# EAGLE design relays (EAGLE 6.6.0)

## Sheet 1 of 3: Connectors & Zero Cross
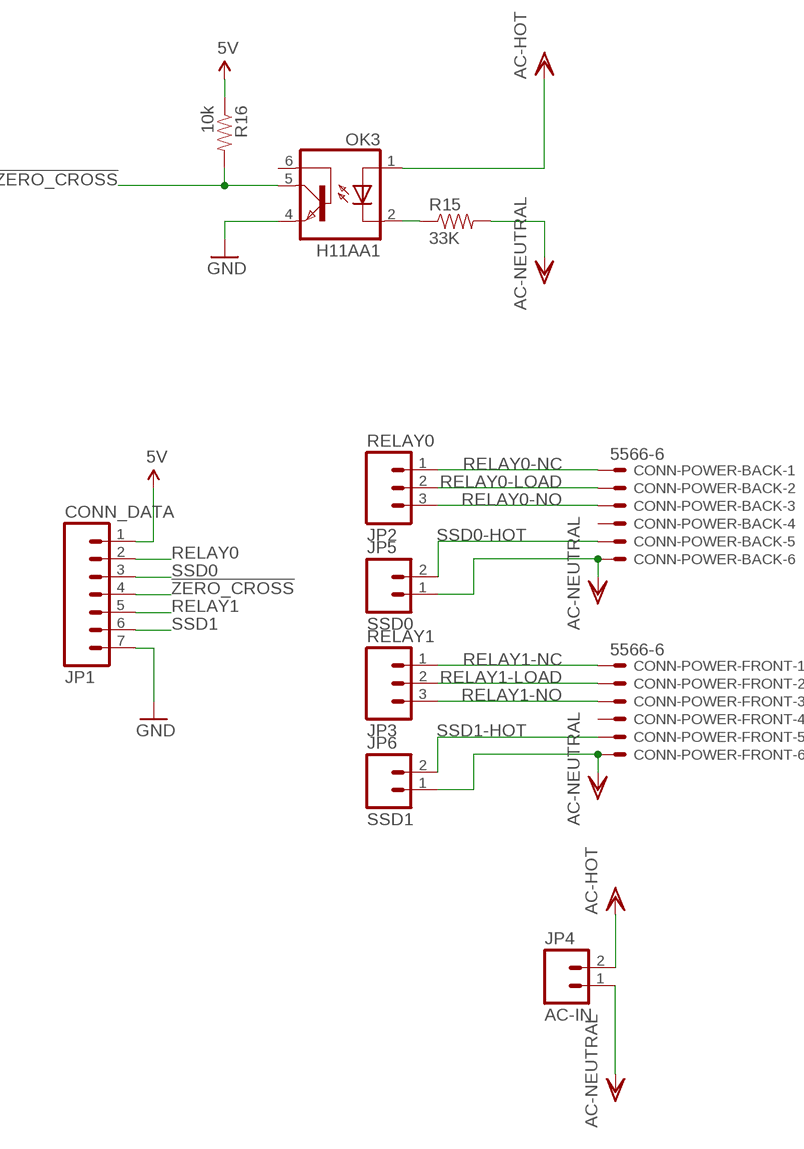
[diagram p0: schematic, sheet 1]

### Parts
CONN-POWER-BACK  5566-6  [5566-6]
CONN-POWER-FRONT  5566-6  [5566-6]
JP1  CONN_DATA  M07LONGPADS  [1X07_LONGPADS]
JP2  RELAY0  M03-SCREW-5MM  [SCREWTERMINAL-5MM-3]
JP3  RELAY1  M03-SCREW-5MM  [SCREWTERMINAL-5MM-3]
JP4  AC-IN  M025MM  [SCREWTERMINAL-5MM-2]
JP5  SSD0  M025MM  [SCREWTERMINAL-5MM-2]
JP6  SSD1  M025MM  [SCREWTERMINAL-5MM-2]
OK3  H11AA1  H11A1SM  [DIL6-SMD]
R15  33K  RESISTOR0603-RES  [0603-RES]
R16  10k  RESISTOR0603-RES  [0603-RES]

### Nets
5V: JP1.1 R16.1 ; also sheet 3
!ZERO_CROSS: JP1.4 OK3.5(COL) R16.2
AC-HOT: JP4.2 OK3.1(A) ; also sheet 2
AC-NEUTRAL: CONN-POWER-BACK.6 CONN-POWER-FRONT.6 JP4.1 JP5.1 JP6.1 R15.2
GND: JP1.7 OK3.4(EMI) ; also sheet 2,3
N$23: OK3.2(C) R15.1
RELAY0: JP1.2 ; also sheet 3
RELAY0-LOAD: CONN-POWER-BACK.2 JP2.2 ; also sheet 3
RELAY0-NC: CONN-POWER-BACK.1 JP2.1 ; also sheet 3
RELAY0-NO: CONN-POWER-BACK.3 JP2.3 ; also sheet 3
RELAY1: JP1.5 ; also sheet 3
RELAY1-LOAD: CONN-POWER-FRONT.2 JP3.2 ; also sheet 3
RELAY1-NC: CONN-POWER-FRONT.1 JP3.1 ; also sheet 3
RELAY1-NO: CONN-POWER-FRONT.3 JP3.3 ; also sheet 3
SSD0: JP1.3 ; also sheet 2
SSD0-HOT: CONN-POWER-BACK.5 JP5.2 ; also sheet 2
SSD1: JP1.6 ; also sheet 2
SSD1-HOT: CONN-POWER-FRONT.5 JP6.2 ; also sheet 2
Unconnected: CONN-POWER-BACK.4 CONN-POWER-FRONT.4 OK3.6(BAS)

## Sheet 2 of 3: Triac SSR
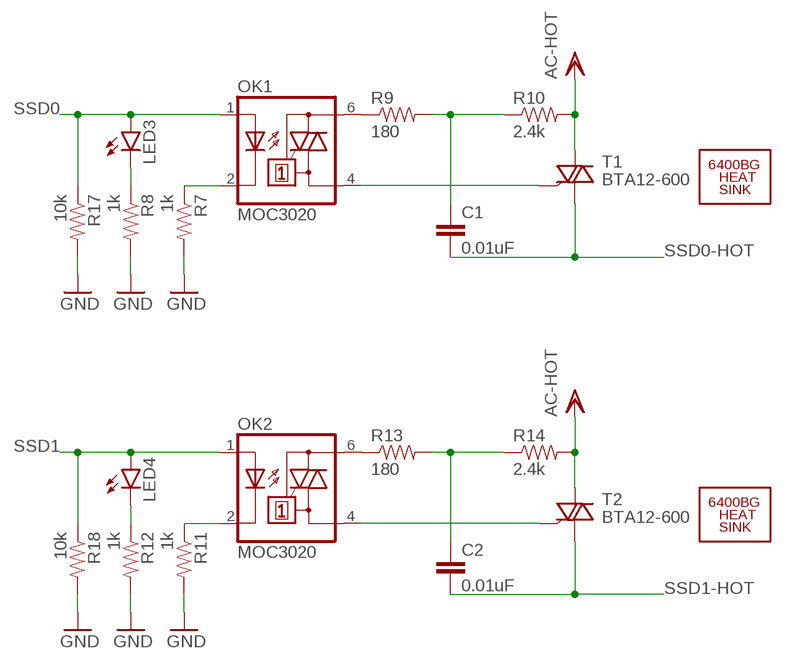
[diagram p1: schematic, sheet 2]

### Parts
C1  0.01uF  CAP0603-CAP  [0603-CAP]
C2  0.01uF  CAP0603-CAP  [0603-CAP]
LED3  LED0603  [LED-0603]
LED4  LED0603  [LED-0603]
OK1  MOC3020  MOC3031S  [DIL6-SMD]
OK2  MOC3020  MOC3031S  [DIL6-SMD]
R7  1k  RESISTOR0603-RES  [0603-RES]
R8  1k  RESISTOR0603-RES  [0603-RES]
R9  180  RESISTOR0603-RES  [0603-RES]
R10  2.4k  RESISTOR0603-RES  [0603-RES]
R11  1k  RESISTOR0603-RES  [0603-RES]
R12  1k  RESISTOR0603-RES  [0603-RES]
R13  180  RESISTOR0603-RES  [0603-RES]
R14  2.4k  RESISTOR0603-RES  [0603-RES]
R17  10k  RESISTOR0603-RES  [0603-RES]
R18  10k  RESISTOR0603-RES  [0603-RES]
T1  BTA12-600  BT136  [TO220AB]
T2  BTA12-600  BT136  [TO220AB]
U$3  6400BG_HEATSINK  [6400BG_HEATSINK]
U$4  6400BG_HEATSINK  [6400BG_HEATSINK]

### Nets
AC-HOT: R10.2 R14.2 T1.2(A2) T2.2(A2) ; also sheet 1
GND: R7.2 R8.2 R11.2 R12.2 R17.2 R18.2 ; also sheet 1,3
N$7: OK1.2(C) R7.1
N$8: LED3.C R8.1
N$10: OK1.6(A2) R9.1
N$11: C1.1 R9.2 R10.1
N$12: OK2.2(C) R11.1
N$13: OK1.4(A1) T1.3(G)
N$14: LED4.C R12.1
N$16: OK2.6(A2) R13.1
N$17: C2.1 R13.2 R14.1
N$18: OK2.4(A1) T2.3(G)
SSD0: LED3.A OK1.1(A) R17.1 ; also sheet 1
SSD0-HOT: C1.2 T1.1(A1) ; also sheet 1
SSD1: LED4.A OK2.1(A) R18.1 ; also sheet 1
SSD1-HOT: C2.2 T2.1(A1) ; also sheet 1

## Sheet 3 of 3: Relay
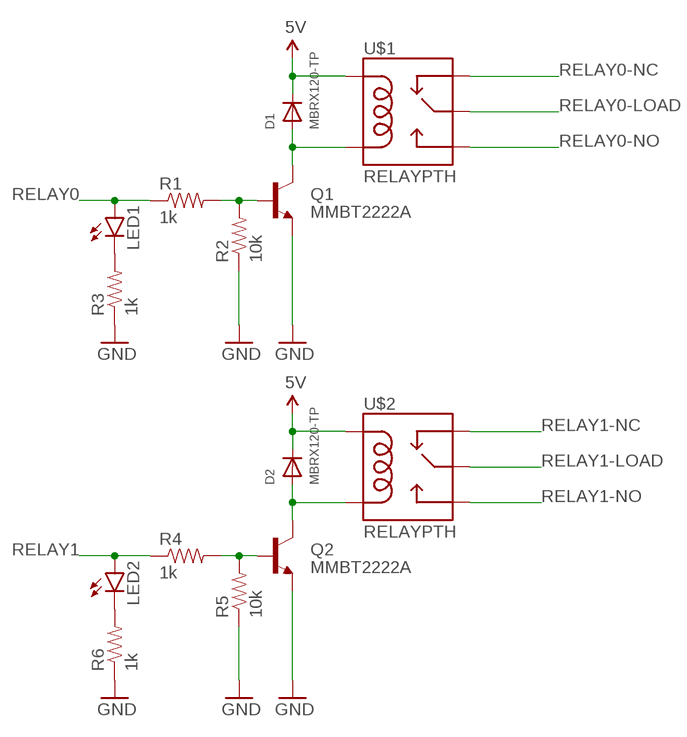
[diagram p2: schematic, sheet 3]

### Parts
D1  MBRX120-TP  DIODESOD-123  [SOD-123]
D2  MBRX120-TP  DIODESOD-123  [SOD-123]
LED1  LED0603  [LED-0603]
LED2  LED0603  [LED-0603]
Q1  MMBT2222A  TRANSISTOR_NPNMMBT2222A  [SOT23-3]
Q2  MMBT2222A  TRANSISTOR_NPNMMBT2222A  [SOT23-3]
R1  1k  RESISTOR0603-RES  [0603-RES]
R2  10k  RESISTOR0603-RES  [0603-RES]
R3  1k  RESISTOR0603-RES  [0603-RES]
R4  1k  RESISTOR0603-RES  [0603-RES]
R5  10k  RESISTOR0603-RES  [0603-RES]
R6  1k  RESISTOR0603-RES  [0603-RES]
U$1  RELAYPTH  [RELAY-G5Q]
U$2  RELAYPTH  [RELAY-G5Q]

### Nets
5V: D1.C D2.C U$1.5(COIL1) U$2.5(COIL1) ; also sheet 1
GND: Q1.2(E) Q2.2(E) R2.1 R3.1 R5.1 R6.1 ; also sheet 1,2
N$1: Q1.1(B) R1.2 R2.2
N$2: LED1.C R3.2
N$3: D1.A Q1.3(C) U$1.1(COIL2)
N$4: Q2.1(B) R4.2 R5.2
N$5: LED2.C R6.2
N$6: D2.A Q2.3(C) U$2.1(COIL2)
RELAY0: LED1.A R1.1 ; also sheet 1
RELAY0-LOAD: U$1.2(MAIN) ; also sheet 1
RELAY0-NC: U$1.4(NC) ; also sheet 1
RELAY0-NO: U$1.3(NO) ; also sheet 1
RELAY1: LED2.A R4.1 ; also sheet 1
RELAY1-LOAD: U$2.2(MAIN) ; also sheet 1
RELAY1-NC: U$2.4(NC) ; also sheet 1
RELAY1-NO: U$2.3(NO) ; also sheet 1

## Library data of the parts
C1 C2 = SparkFun-Passives:CAP: Capacitor Standard 0603 ceramic capacitor, and 0.1" leaded capacitor.
CONN-POWER-BACK CONN-POWER-FRONT = con-molex:5566-6: Mini FIT connector 6 pol Source: http://www.molex.com; MPN: 95566-61002; OC_FARNELL: unknown; OC_NEWARK: 22K8620
D1 D2 = adafruit:DIODE: Diode SMADIODE - SMA Surface Mount Package 20V 1A Schottky Diode Digikey: 641-1014-6-ND DO-1N4148 - Through Hole Small Current Diode SOD-123 20V 1 A (.5mV Vf) Schottky Diode - Digikey: MBRX120TPMSCT-ND SOD-323 10V 570mA (.38mV Vf, 3ns) Schottky Diode - Digikey: ZLLS410CT-ND SOD-523 30V 30mA Schottky Diode (RB751S-40TE61) - Digikey: RB751S-40TE61CT-ND SOT23-R/W - SOT23 Package (R = Solder Paste/Reflow Ovens, W = Hand-Soldering) BAT54Film 40V 300mA - Digikey: 497-7162-1-ND
JP1 = SparkFun-Connectors:M07: Header 7 Standard 7-pin 0.1" header. Use with straight break away headers (SKU : PRT-00116), right angle break away headers (PRT-00553), swiss pins (PRT-00743), machine pins (PRT-00117), and female headers (PRT-00115). NOTES ON THE VARIANTS LOCK and LOCK_LONGPADS... This footprint was designed to help hold the alignment of a through-hole component (i.e. 7-pin header) while soldering it into place. You may notice that each hole has been shifted either up or down by 0.005 of an inch from it's more standard position (which is usually a perfectly straight line). This slight alteration caused the pins (the squares in the middle) to touch the edges of the holes. Because they are alternating, it causes a "brace" to hold the header in place. 0.005 has proven to be the perfect amount of "off-center" position when using our standard breakaway headers. Although looks a little odd when you look at the bare footprint, once you have a header in there, the alteration is very hard to notice. Also, if you push a header all the way into place, it is covered up entirely on the bottom side. This idea of altering the position of holes to aid alignment will be further integrated into the Sparkfun Library for other footprints. It can help hold any component with 3 or more connection pins.
JP2 JP3 = SparkFun-Connectors:M03: Header 3 Standard 3-pin 0.1" header. Use with straight break away headers (SKU : PRT-00116), right angle break away headers (PRT-00553), swiss pins (PRT-00743), machine pins (PRT-00117), and female headers (PRT-00115). Molex polarized connector foot print use with SKU : PRT-08232 with associated crimp pins and housings.; STOREFRONT_ID: PRT-08433
JP4-JP6 = SparkFun-Connectors:M02: Standard 2-pin 0.1" header. Use with - straight break away headers ( PRT-00116) - right angle break away headers (PRT-00553) - swiss pins (PRT-00743) - machine pins (PRT-00117) - female headers (PRT-00115) Molex polarized connector foot print use with: PRT-08233 with associated crimp pins and housings. 2.54_SCREWTERM for use with PRT-10571. 3.5mm Screw Terminal footprints for PRT-08084 5mm Screw Terminal footprints for use with PRT-08432; STOREFRONT_ID: PRT-08432
LED1-LED4 = SparkFun-LED:LED: LEDs Standard schematic elements and footprints for 5mm, 3mm, 1206, and 0603 sized LEDs. 5mm - Spark Fun Electronics SKU : COM-00529 (and others)
OK1 OK2 = optocoupler:MOC30*: 6-Pin DIP Zero-Cross Optoisolators Triac Driver Output (250/400 Volt Peak) Source: Data sheet <http://www.fairchildsemi.com/ds/MO/MOC3031M.pdf> The old path of data sheet not more available 2013-05-06.; MF: FAIRCHILD SEMICONDUCTOR; MPN: MOC3031SM; OC_FARNELL: unknown; OC_NEWARK: 34C1335
OK3 = optocoupler:H11A*?M: General Purpose 6-Pin Phototransistor Optocouplers Source: http://www.fairchildsemi.com/ds/4N/4N35-M.pdf; OC_FARNELL: unknown; OC_NEWARK: unknown
Q1 Q2 = SparkFun-DiscreteSemi:TRANSISTOR_NPN: Generic NPN BJT MMBT2222A - TRANS-08049 (SOT-23, 1A 40V) MPSA42 - TRANS-09116 (SOT-23, 500mA 300V) MMBT5088LT1G - TRANS-11160 (SOT-23, 50 mA 30V) BC547 - COM-08928 <http://www.sparkfun.com/products/8928> (TO-92 45V 100mA) (1.Collector 2.Base 3.Emitter) 2N3904 - COM-00521 <http://www.sparkfun.com/products/521> (TO-92 40V 200mA) (1.Emitter 2.Base 3.Collector) P2N2222A - COM-12852 <http://www.sparkfun.com/products/12852> (TO-92 40V 600mA) (1.Collector 2.Base 3.Emitter); PROD_ID: TRANS-08049
R1-R18 = SparkFun-Passives:RESISTOR: Resistor Basic schematic elements and footprints for 0603, 1206, and PTH resistors.
T1 T2 = triac:BT136: Triac BT136 series E sensitive gate Source: http://www.nxp.com/acrobat_download/datasheets/BT136_SERIES_E_2.pdf
U$1 U$2 = SparkFun-Electromechanical:RELAY: SPDT relay (COM-00101)
U$3 U$4 = SparkFun-Electromechanical:6400BG_HEATSINK: Multiwatt heatsink, PRT-09576

## Board
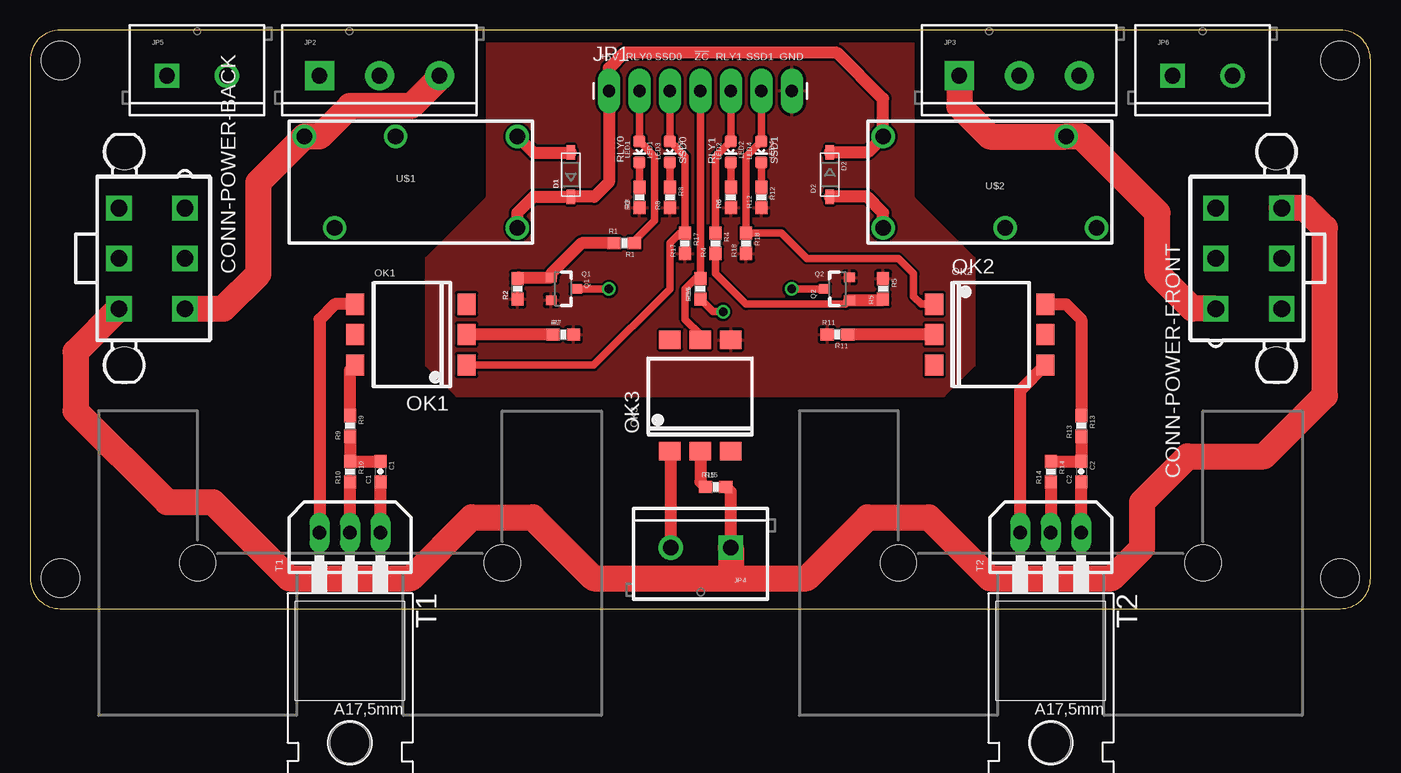
[diagram p3: board, top side]
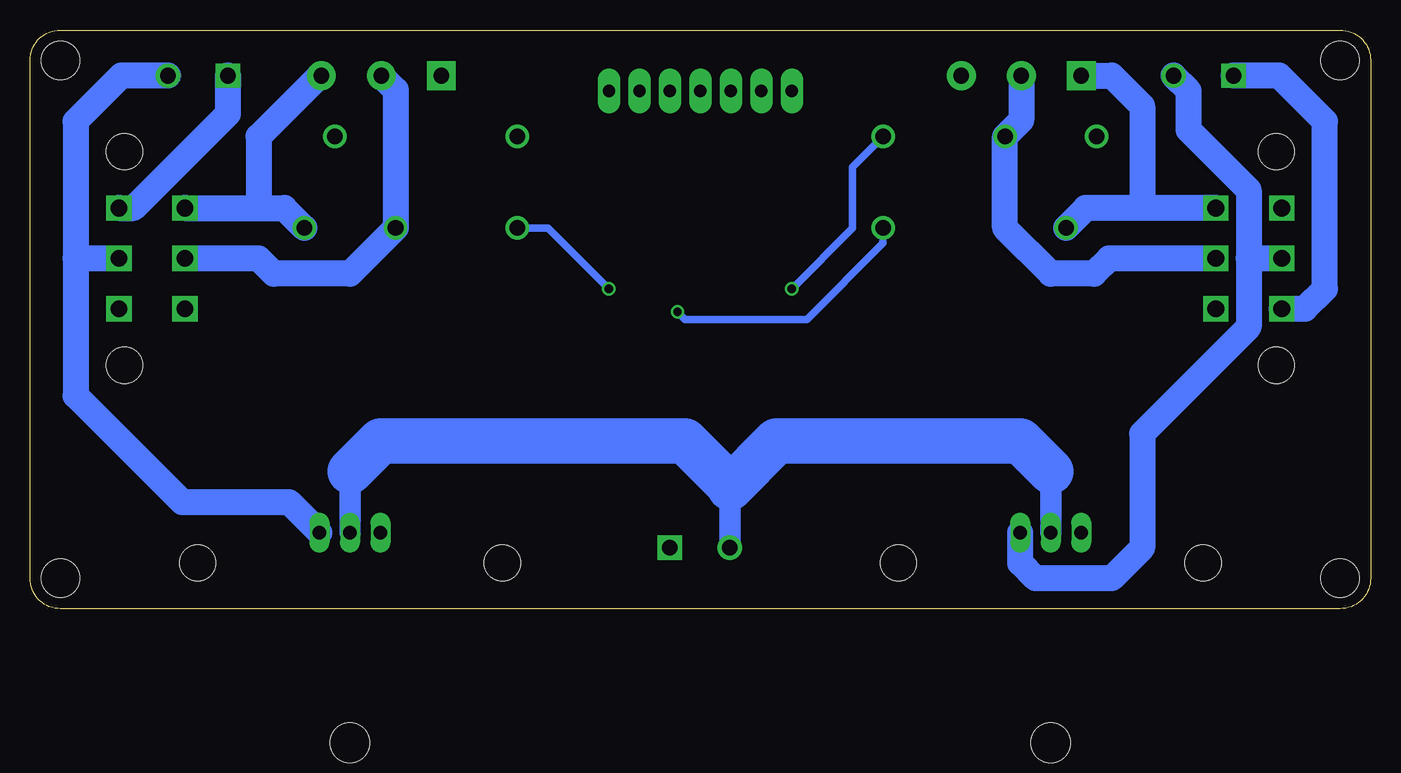
[diagram p4: board, bottom side, seen from below]

Size 111.76 x 48.26 mm. Coordinates in mm from the lower left corner, seen from the top.
Outline: 0,45.72 0,2.54 arc90 2.54,0 109.22,0 arc90 111.76,2.54 111.76,45.72 arc90 109.22,48.26 2.54,48.26 arc90 0,45.72
Copper layers (1*16): Top 0.035mm / dielectric 1.5mm / Bottom 0.035mm
Design rules "default": minimum track width 10mil, minimum drill 24mil, track to track 8mil, track to pad 8mil, pad to pad 8mil, via to via 8mil, smd to smd 8mil, copper to edge 40mil, drill to drill 8mil, minimum pad ring 10mil, minimum via ring 8mil, stop-mask expansion 4mil, vias tented up to drill 0mil, thermal gap 10mil
Holes 3.2 mm at 2.54,45.72 2.54,2.54 109.22,2.54 109.22,45.72

### Footprints (pad centres in the part's own frame; a part is rotated, then mirrored left to right if it is on the bottom)
0603-CAP = smd 1.1 x 1: 1 -0.85,0; 2 0.85,0
5566-6 = drill 1.4 square: 1 4.2,-2.75; 2 0,-2.75; 3 -4.2,-2.75; 4 4.2,2.75; 5 0,2.75; 6 -4.2,2.75 | hole 3: 8.9,2.29; -8.9,2.29
SOD-123 = smd 1.2 x 0.7: A 1.85,0; C -1.85,0
1X07_LONGPADS = drill 1.016 pad 1.88 long: 1 0,0; 2 2.54,0; 3 5.08,0; 4 7.62,0; 5 10.16,0; 6 12.7,0; 7 15.24,0
SCREWTERMINAL-5MM-3 = drill 1.3 pad 2.413 square: 1 0,0 | drill 1.3 pad 2.413: 2 5,0; 3 10,0
SCREWTERMINAL-5MM-2 = drill 1.3 pad 2.032 square: 1 0,0 | drill 1.3 pad 2.032: 2 5,0
LED-0603 = smd 1 x 1: A 0,-0.877; C 0,0.877
DIL6-SMD = smd 1.78 x 1.52: 1 -2.54,-4.645; 2 0,-4.645; 3 2.54,-4.645; 4 2.54,4.645; 5 0,4.645; 6 -2.54,4.645
SOT23-3 = smd 0.8 x 0.9: 1 -0.95,-1; 2 0.95,-1; 3 0,1.1
0603-RES = smd 1.1 x 1: 1 -0.85,0; 2 0.85,0
TO220AB = drill 1.118 long: 1 -2.54,-6.35; 2 0,-6.35; 3 2.54,-6.35 | hole 3.302: 0,11.176
RELAY-G5Q = drill 1.3: 1 8.89,3.81; 2 -1.27,3.81; 3 -8.89,3.81; 4 -6.35,-3.81; 5 8.89,-3.81
6400BG_HEATSINK = hole 2.997: -12.7,0; 12.7,0

### Placement (x,y rotation side)
C1  29.21,11.43 270 top
C2  87.63,11.43 270 top
CONN-POWER-BACK  10.16,29.21 90 top
CONN-POWER-FRONT  101.6,29.21 270 top
D1  45.09,36.2 90 top
D2  66.67,36.2 270 top
JP1  48.26,43.18 0 top
JP2  24.13,44.45 0 top
JP3  77.47,44.45 0 top
JP4  58.42,5.08 180 top
JP5  11.43,44.45 0 top
JP6  95.25,44.45 0 top
LED1  50.8,38.1 180 top
LED2  58.42,38.1 180 top
LED3  53.34,38.1 180 top
LED4  60.96,38.1 180 top
OK1  31.75,22.86 90 top
OK2  80.01,22.86 270 top
OK3  55.88,17.78 0 top
Q1  44.45,26.67 270 top
Q2  67.31,26.67 90 top
R1  49.53,30.48 180 top
R2  40.64,26.67 90 top
R3  50.8,34.29 90 top
R4  57.15,30.48 270 top
R5  71.12,26.67 270 top
R6  58.42,34.29 90 top
R7  44.45,22.86 0 top
R8  53.34,34.29 270 top
R9  26.67,15.24 270 top
R10  26.67,11.43 270 top
R11  67.31,22.86 180 top
R12  60.96,34.29 270 top
R13  87.63,15.24 270 top
R14  85.09,11.43 270 top
R15  57.15,10.16 0 top
R16  55.88,26.67 90 top
R17  54.61,30.48 270 top
R18  59.69,30.48 270 top
T1  26.67,0 180 top
T2  85.09,0 180 top
U$1  31.75,35.56 0 top
U$2  80.01,35.56 180 top
U$3  26.67,3.81 180 top
U$4  85.09,3.81 180 top

### Tracks (layer width: path | path; a pad name or v marks a point on that pad's centre or on a via)
5V  (via drill 0.7)
  Top 0.61: R16.1 56.94,24.77 v57.78,24.77
  Top 1.016: U$1.5 40.64,33.02 41.97,34.34 D1.C 47.05,34.34 48.26,35.56 JP1.1 48.26,45.09 49.53,46.35 67.31,46.35 71.12,42.55 U$2.5 69.8,38.05 D2.C
  Bottom 0.61: v57.78,24.77 57.15,24.13 46.99,24.13 40.64,30.48 U$1.5
!ZERO_CROSS
  Top 0.61: JP1.4 R16.2 55.46,27.52 54.61,26.67 54.61,24.13 55.88,22.86 OK3.5
AC-HOT
  Top 1.016: T1.2 R10.2 | R14.2 T2.2 | JP4.2 53.42,13.05 OK3.1
  Bottom 1.778: JP4.2 53.42,10.08 53.42,10.24 | 26.67,11.43 T1.2 | 85.09,11.43 T2.2
  Bottom 3.81: 53.42,10.08 49.53,13.97 29.21,13.97 26.67,11.43 | 53.42,10.24 57.15,13.97 82.55,13.97 85.09,11.43
AC-NEUTRAL
  Top 1.016: JP4.1 58.42,9.74 R15.2
  Top 2.184: CONN-POWER-BACK.6 3.81,21.41 3.81,16.51 11.43,8.89 15.24,8.89 21.59,2.54 31.75,2.54 36.83,7.62 41.91,7.62 46.99,2.54 58.42,2.54 | 58.42,2.54 64.77,2.54 69.85,7.62 74.93,7.62 80.01,2.54 90.17,2.54 92.71,5.08 92.71,8.89 96.52,12.7 102.87,12.7 107.95,17.78 107.95,31.75 106.29,33.41 CONN-POWER-FRONT.6 | JP4.1 58.42,2.54
  Bottom 2.184: CONN-POWER-BACK.6 5.47,25.01 3.81,26.67 3.81,40.64 7.62,44.45 JP5.1 | CONN-POWER-FRONT.6 103.11,33.41 95.25,41.27 JP6.1
GND
  pour Top: 38.1,49.53 38.1,34.29 33.02,29.21 33.02,20.32 35.56,17.78 76.2,17.78 78.74,20.32 78.74,29.21 73.66,34.29 73.66,49.53
N$1
  Top 1.016: R2.2 40.74,27.62 Q1.1 43.45,27.94 45.99,30.48 R1.2
N$2
  Top 0.61: R3.2 LED1.C
N$3  (via drill 0.7)
  Top 0.61: Q1.3 v48.26,26.67
  Top 1.016: U$1.1 41.97,38.05 D1.A
  Bottom 0.61: v48.26,26.67 43.18,31.75 43.18,36.83 U$1.1
N$4
  Top 0.61: Q2.1 67.99,25.4 59.69,25.4 57.15,27.94 R4.2
  Top 1.016: Q2.1 71.02,25.72 R5.2
N$5
  Top 0.61: R6.2 LED2.C
N$6  (via drill 0.7)
  Top 0.61: Q2.3 v63.5,26.67
  Top 1.016: U$2.1 71.12,33.02 69.8,34.34 D2.A
  Bottom 0.61: v63.5,26.67 68.58,31.75 U$2.1
N$7
  Top 1.016: R7.1 OK1.2
N$8
  Top 0.61: R8.1 LED3.C
N$10
  Top 1.016: R9.1 26.67,19.89 OK1.6
N$11
  Top 1.016: C1.1 R10.1 R9.2
N$12
  Top 1.016: OK2.2 R11.1
N$13
  Top 1.016: OK1.4 25.4,25.4 24.13,24.13 T1.3
N$14
  Top 0.61: R12.1 LED4.C
N$16
  Top 1.016: OK2.6 86.36,25.4 87.63,24.13 R13.1
N$17
  Top 1.016: R13.2 C2.1 R14.1
N$18
  Top 1.016: T2.3 82.55,18.21 OK2.4
N$23
  Top 1.016: OK3.2 55.88,10.58 R15.1
RELAY0
  Top 0.61: JP1.2 LED1.A 52.07,37.71 52.07,32.38 50.38,30.7 R1.1
RELAY0-LOAD
  Bottom 2.184: JP2.2 29.13,40.72 U$1.2 30.48,31.75 26.67,27.94 23.07,27.94 21.8,29.21 CONN-POWER-BACK.2
RELAY0-NC
  Bottom 2.184: CONN-POWER-BACK.1 19.05,33.41 | 19.05,33.41 23.74,33.41 U$1.4 | JP2.1 21.59,44.45 19.05,41.91 19.05,33.41
RELAY0-NO
  Top 2.184: JP2.3 34.13,44.29 31.75,41.91 26.67,41.91 24.13,39.37 U$1.3 19.05,35.56 19.05,27.94 16.12,25.01 CONN-POWER-BACK.3
RELAY1
  Top 0.61: JP1.5 LED2.A 57.15,37.71 R4.1
RELAY1-LOAD
  Bottom 2.184: JP3.2 81.28,43.26 U$2.2 85.09,27.94 91.44,27.94 92.71,29.21 CONN-POWER-FRONT.2
RELAY1-NC
  Top 2.184: JP3.1 77.47,41.91 80.01,39.37 U$2.4 87.63,39.37 93.98,33.02 93.98,27.94 96.91,25.01 CONN-POWER-FRONT.1
RELAY1-NO
  Bottom 2.184: CONN-POWER-FRONT.3 92.71,33.41 | 92.71,33.41 90.56,33.41 U$2.3 | JP3.3 87.63,44.45 92.71,39.37 92.71,33.41
SSD0
  Top 0.61: JP1.3 LED3.A 54.61,37.71 R17.1 54.19,31.33 53.34,30.48 53.34,26.67 46.99,20.32 OK1.1
SSD0-HOT
  Top 1.016: T1.1 C1.2
  Bottom 2.184: 10.16,29.21 10.16,34.92 15.16,39.92 15.16,43.18 JP5.2 | 10.16,29.21 10.16,23.5 19.05,14.61 19.05,5.08 21.59,2.54 27.94,2.54 29.21,3.81 T1.1 | CONN-POWER-BACK.5 10.16,29.21
SSD1
  Top 0.61: JP1.6 LED4.A 59.69,37.71 R18.1 62.65,31.33 64.77,29.21 72.39,29.21 73.66,27.94 73.66,26.04 74.3,25.4 OK2.1
SSD1-HOT
  Top 1.016: T2.1 C2.2
  Bottom 2.184: 107.95,29.21 107.95,40.64 104.14,44.45 JP6.2 | 107.95,29.21 107.95,17.78 99.06,8.89 90.17,8.89 T2.1 | CONN-POWER-FRONT.5 107.95,29.21

### Text on the board
_tsilk: +5V | RLY0 | SSD0 | !ZC | RLY1 | SSD1 | GND | LED1 | RLY0 | LED3 | SSD0 | RLY1 | LED2 | LED4 | SSD1 | D1 | D2 | R3 | R8 | R6 | R12 | R1 | R17 | R4 | R18 | OK1 | Q1 | Q2 | OK2 | R2 | R16 | R5 | R7 | R11 | OK3 | R9 | R13 | R15 | R10 | C1 | R14 | C2 | T1 | T2